# EAGLE schematic hub (EAGLE 8.4.3)
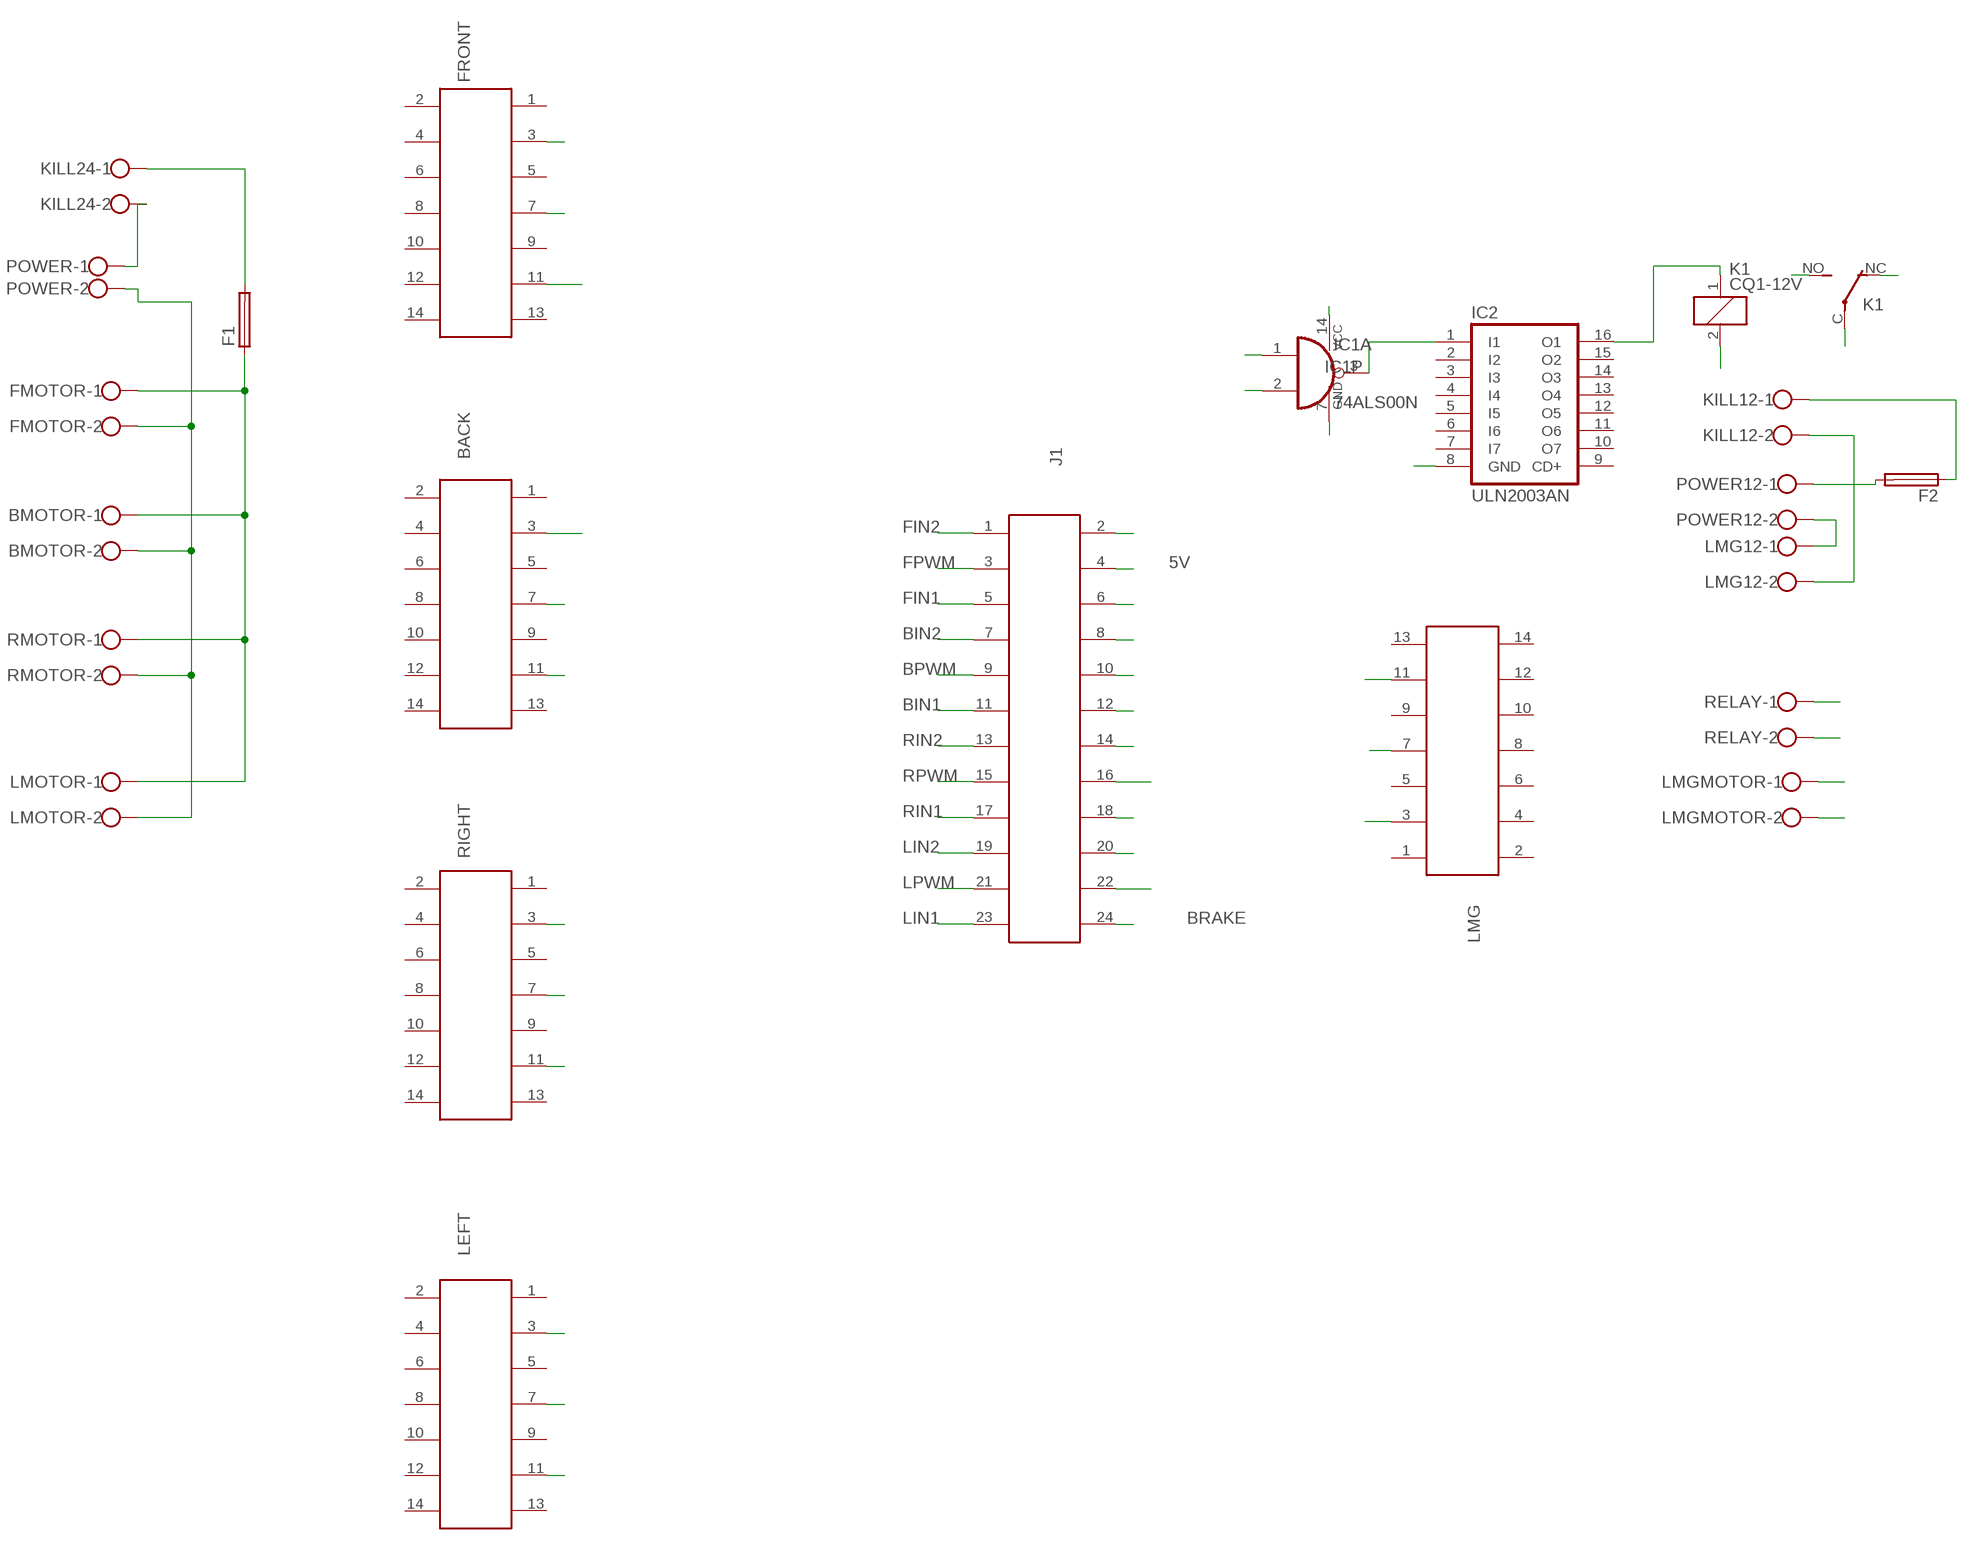
[diagram p0: schematic, sheet 1]

## Parts
BACK  612014235121  [612014235121]
BMOTOR  W237-102  [W237-102]
F1  GSH15  [GSH15]
F2  GSH15  [GSH15]
FMOTOR  W237-102  [W237-102]
FRONT  612014235121  [612014235121]
IC1  74ALS00N  [DIL14]
IC2  ULN2003AN  [DIL16]
J1  61202421621  [61202421621]
K1  CQ1-12V  [CQ1]
KILL12  W237-102  [W237-102]
KILL24  W237-102  [W237-102]
LEFT  612014235121  [612014235121]
LMG  612014235121  [612014235121]
LMG12  W237-102  [W237-102]
LMGMOTOR  W237-102  [W237-102]
LMOTOR  W237-102  [W237-102]
POWER  W237-102  [W237-102]
POWER12  W237-102  [W237-102]
RELAY  W237-102  [W237-102]
RIGHT  612014235121  [612014235121]
RMOTOR  W237-102  [W237-102]

## Nets
5V: IC1.1(A:I0) IC1.14(P:VCC) J1.4 K1.2
24V: BMOTOR.1 F1.1 FMOTOR.1 LMOTOR.1 RMOTOR.1
BIN1: BACK.3 J1.11
BIN2: BACK.11 J1.7
BPWM: BACK.7 J1.9
BRAKE: IC1.2(A:I1) J1.24
COM: K1.C(2:P) LMGMOTOR.2 RELAY.2
FIN1: FRONT.3 J1.5
FIN2: FRONT.11 J1.1
FPWM: FRONT.7 J1.3
GND: BMOTOR.2 FMOTOR.2 IC1.7(P:GND) IC2.8(GND) LMOTOR.2 POWER.2 RMOTOR.2
LIN1: J1.23 LEFT.3
LIN2: J1.19 LEFT.11
LMG1: J1.14 LMG.3
LMG2: J1.18 LMG.11
LMGPWM: J1.16 LMG.7
LPWM: J1.21 LEFT.7
N$1: F1.2 KILL24.1
N$3: IC1.3(A:O) IC2.1(I1)
N$4: F2.2 POWER12.1
N$6: IC2.16(O1) K1.1
N$7: KILL12.2 LMG12.2
N$9: KILL24.2 POWER.1
N$10: K1.NC(2:O)
N$11: F2.1 KILL12.1
N$13: LMG12.1 POWER12.2
N$16: J1.2
N$18: J1.6
N$19: J1.8
N$20: J1.10
N$21: J1.12
N$25: J1.20
N$26: J1.22
NO: K1.NO(2:S) LMGMOTOR.1 RELAY.1
RIN1: J1.17 RIGHT.3
RIN2: J1.13 RIGHT.11
RPWM: J1.15 RIGHT.7
Unconnected: BACK.1 BACK.2 BACK.4 BACK.5 BACK.6 BACK.8 BACK.9 BACK.10 BACK.12 BACK.13 BACK.14 FRONT.1 FRONT.2 FRONT.4 FRONT.5 FRONT.6 FRONT.8 FRONT.9 FRONT.10 FRONT.12 FRONT.13 FRONT.14 IC1.4(B:I0) IC1.5(B:I1) IC1.6(B:O) IC1.8(C:O) IC1.9(C:I0) IC1.10(C:I1) IC1.11(D:O) IC1.12(D:I0) IC1.13(D:I1) IC2.2(I2) IC2.3(I3) IC2.4(I4) IC2.5(I5) IC2.6(I6) IC2.7(I7) IC2.9(CD+) IC2.10(O7) IC2.11(O6) IC2.12(O5) IC2.13(O4) IC2.14(O3) IC2.15(O2) LEFT.1 LEFT.2 LEFT.4 LEFT.5 LEFT.6 LEFT.8 LEFT.9 LEFT.10 LEFT.12 LEFT.13 LEFT.14 LMG.1 LMG.2 LMG.4 LMG.5 LMG.6 LMG.8 LMG.9 LMG.10 LMG.12 LMG.13 LMG.14 RIGHT.1 RIGHT.2 RIGHT.4 RIGHT.5 RIGHT.6 RIGHT.8 RIGHT.9 RIGHT.10 RIGHT.12 RIGHT.13 RIGHT.14

## Library data of the parts
BACK FRONT LEFT LMG RIGHT = Wurth_Elektronik_Electromechanic_Wire_to_Board_Connectors_rev17b:612014235121: WR-BHD 2.54mm Male Box Header High Temperature, 14 Pins=>Code : Con_WTB_BHD_2.54_Male_THT_RS_612014235121 <http://katalog.we-online.de/media/thumbs2/eican/thb_Con_WTB_BHD_2.54_Male_THT_RS_6120xx235121_pf2.jpg> Details see: http://katalog.we-online.de/en/em/612_0xx_235_121 Created 2014-06-05, Karrer Zheng 2014 (C) Würth Elektronik
BMOTOR FMOTOR KILL12 KILL24 LMG12 LMGMOTOR LMOTOR POWER POWER12 RELAY RMOTOR = con-wago-500:W237-102: WAGO SCREW CLAMP; MPN: 237-102; OC_FARNELL: unknown; OC_NEWARK: 70K9898
F1 F2 = fuse:GSH15: FUSE HOLDER grid 15mm, 19649 Wickmann; MPN: 64900001039; OC_FARNELL: 1271673; OC_NEWARK: 02P0318
IC1 = 74xx-eu:74*00: Quad 2-input NAND gate
IC2 = uln-udn:ULN2003A: DRIVER ARRAY
J1 = Wurth_Elektronik_Electromechanic_Wire_to_Board_Connectors_rev17b:61202421621: WR-BHD 2.54mm Male Box Header, 24 Pins=>Code : Con_WTB_BHD_2.54_Male_THT_WS_61202421621 <http://katalog.we-online.de/media/thumbs2/eican/thb_Con_WTB_BHD_2.54_Male_THT_WS_6120xx21621_pf2.jpg> Details see: http://katalog.we-online.de/en/em/612_0xx_216_21 Created 2014-06-04, Karrer Zheng 2014 (C) Würth Elektronik
K1 = relay:CQ1-12V: AUTOMOTIVE QUIET RELAY NAiS Source: http://www.mew-europe.com/.. en_ds_61208_0000.pdf; OC_FARNELL: unknown; OC_NEWARK: unknown